# Altium schematic sheet Sheet1.SchDoc
size B; Organization: Cobus Projects; Revision: 1.0; Time: Shared Circuitry; ProjectName: Wireless Relay Controller
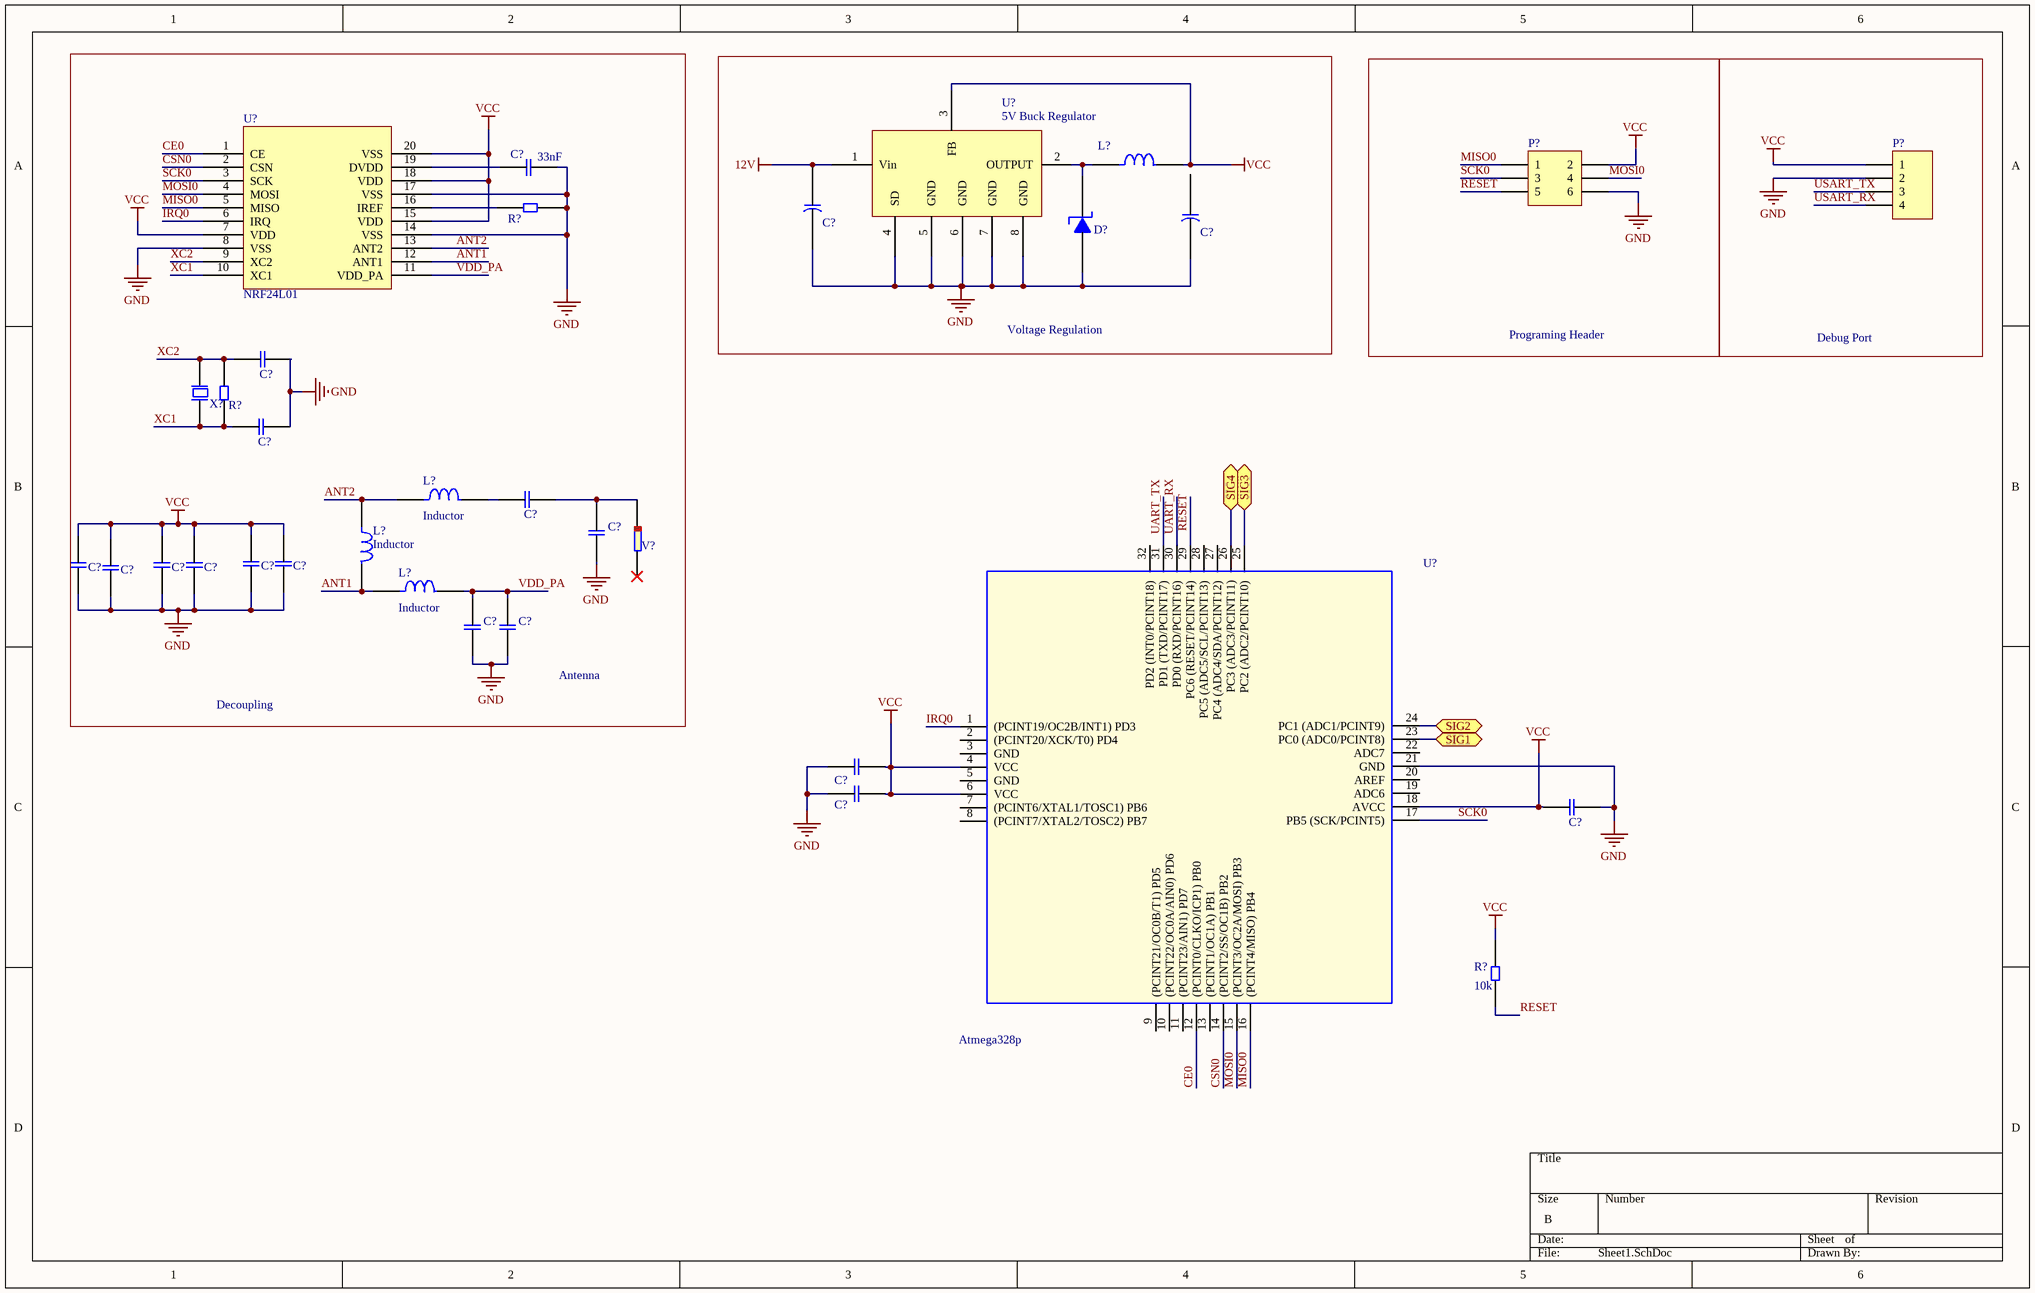
[diagram p0: Sheet1.SchDoc]

## Parts
(Parts that share a designator on the sheet are numbered #1, #2 ... from top to bottom, then left to right.)
C?#1  value 33nF  [0402-Footprint]  (hidden comment: *)
C?#2  Capacitor-Pol  (value not drawn)
C?#3  Capacitor-Pol  (value not drawn)
C?#4  *  [0402-Footprint]  (value not drawn)
C?#5  *  [0402-Footprint]  (value not drawn)
C?#6  *  [0402-Footprint]  (value not drawn)
C?#7  *  [0402-Footprint]  (value not drawn)
C?#8  *  [0402-Footprint]  (value not drawn)
C?#9  *  [0402-Footprint]  (value not drawn)
C?#10  *  [0402-Footprint]  (value not drawn)
C?#11  *  [0402-Footprint]  (value not drawn)
C?#12  *  [0402-Footprint]  (value not drawn)
C?#13  *  [0402-Footprint]  (value not drawn)
C?#14  *  [0402-Footprint]  (value not drawn)
C?#15  *  [0402-Footprint]  (value not drawn)
C?#16  Capacitor  [0402-Footprint]  (value not drawn)
C?#17  Capacitor  [0402-Footprint]  (value not drawn)
C?#18  Capacitor  [0402-Footprint]  (value not drawn)
D?  Schottky Diode  [SOT95P245X110-3N]  (value not drawn)
L?#1  Inductor  [INDP127127X40N]  (value not drawn)
L?#2  Inductor  [0402-Footprint]
L?#3  Inductor  [0402-Footprint]
L?#4  Inductor  [0402-Footprint]
P?#1  (no value)  [HDR2X3]
P?#2  (no value)  [HDR1X4]
R?#1  *  [0402-Footprint]  (value not drawn)
R?#2  *  [0402-Footprint]  (value not drawn)
R?#3  value 10k  [0402-Footprint]  (hidden comment: Resistor)
U?#1  5V Buck Regulator  [SOP127P600X175-8N]
U?#2  NRF24L01  [QFN50P408X408X80_HS-21N]
U?#3  Atmega328p  [TQFP80P900X900X120-32N]
V?  ANTENNA  [Chip Antenna]  (value not drawn)
X?  *  [HC49/US]  (value not drawn)

## Blocks framed on the sheet
Voltage Regulation: C?#2 C?#3 D? L?#1 U?#1

## Ports
SIG1 (bidir), SIG2 (bidir), SIG3 (bidir), SIG4 (bidir)

## Nets
12V: C?#2.1 U?#1.1(Vin)
GND: C?#1.2 C?#2.2 C?#3.2 C?#4.2 C?#5.2 C?#7.2 C?#8.2 C?#9.2 C?#10.2 C?#11.2 C?#12.2 C?#13.2 C?#14.2 C?#15.2 C?#16.1 C?#17.1 C?#18.2 D?.1 P?#1.6 P?#2.2 R?#1.2 U?#1.4(SD) U?#1.5(GND) U?#1.6(GND) U?#1.7(GND) U?#1.8(GND) U?#2.8(VSS) U?#2.14(VSS) U?#2.17(VSS) U?#3.21(GND)
VCC: C?#8.1 C?#9.1 C?#10.1 C?#11.1 C?#12.1 C?#13.1 C?#16.2 C?#17.2 C?#18.1 L?#1.2 P?#1.2 P?#2.1 R?#3.2 U?#1.3(FB) U?#2.7(VDD) U?#2.15(VDD) U?#2.18(VDD) U?#2.20(VSS) U?#3.4(VCC) U?#3.6(VCC) U?#3.18(AVCC)
ANT1: L?#2.2 L?#4.1 U?#2.12(ANT1)
ANT2: L?#2.1 L?#3.1 U?#2.13(ANT2)
CE0: U?#2.1(CE) U?#3.12((PCINT0/CLKO/ICP1)_PB0)
CSN0: U?#2.2(CSN) U?#3.14((PCINT2/SS/OC1B)_PB2)
IRQ0: U?#2.6(IRQ) U?#3.1((PCINT19/OC2B/INT1)_PD3)
MISO0: P?#1.1 U?#2.5(MISO) U?#3.16((PCINT4/MISO)_PB4)
MOSI0: P?#1.4 U?#2.4(MOSI) U?#3.15((PCINT3/OC2A/MOSI)_PB3)
RESET: P?#1.5 R?#3.1 U?#3.29(PC6_(RESET/PCINT14))
SCK0: P?#1.3 U?#2.3(SCK) U?#3.17(PB5_(SCK/PCINT5))
SIG1: U?#3.23(PC0_(ADC0/PCINT8)) ; port SIG1
SIG2: U?#3.24(PC1_(ADC1/PCINT9)) ; port SIG2
SIG3: U?#3.25(PC2_(ADC2/PCINT10)) ; port SIG3
SIG4: U?#3.26(PC3_(ADC3/PCINT11)) ; port SIG4
UART_RX: U?#3.30(PD0_(RXD/PCINT16))
UART_TX: U?#3.31(PD1_(TXD/PCINT17))
USART_RX: P?#2.4
USART_TX: P?#2.3
VDD_PA: C?#14.1 C?#15.1 L?#4.2 U?#2.11(VDD_PA)
XC1: C?#5.1 R?#2.1 U?#2.10(XC1) X?.1
XC2: C?#4.1 R?#2.2 U?#2.9(XC2) X?.2
NetC?#1_1: C?#1.1 U?#2.19(DVDD)
NetC?#6_1: C?#6.1 L?#3.2
NetC?#6_2: C?#6.2 C?#7.1 V?.1
NetD?_3: D?.3 L?#1.1 U?#1.2(OUTPUT)
NetR?#1_1: R?#1.1 U?#2.16(IREF)

Not connected (* = marked no-connect by the designer): C?#3 1; U?#3 2((PCINT20/XCK/T0)_PD4) 3(GND) 5(GND) 7((PCINT6/XTAL1/TOSC1)_PB6) 8((PCINT7/XTAL2/TOSC2)_PB7) 9((PCINT21/OC0B/T1)_PD5) 10((PCINT22/OC0A/AIN0)_PD6) 11((PCINT23/AIN1)_PD7) 13((PCINT1/OC1A)_PB1) 19(ADC6) 20(AREF) 22(ADC7) 27(PC4_(ADC4/SDA/PCINT12)) 28(PC5_(ADC5/SCL/PCINT13)) 32(PD2_(INT0/PCINT18)); V? 2*

## Notes on the sheet
- Programing Header
- Debug Port
- Decoupling
- Antenna

## Library data of the parts
C?#1 C?#4-C?#15 = Capacitor
C?#2 C?#3 = Capacitor-Pol: value: 20pF
D? = Diode-Scchottky: Part #: BAT54-FDICT-ND
P?#1 = Header 3X2: Header, 3-Pin, Dual row; LatestRevisionDate: 17-Jul-2002; LatestRevisionNote: Re-released for DXP Platform.; Publisher: Altium Limited
P?#2 = Header 4: Header, 4-Pin; LatestRevisionDate: 17-Jul-2002; LatestRevisionNote: Re-released for DXP Platform.; Publisher: Altium Limited
R?#1 R?#2 = Resistor
U?#1 = AP1509-Buck_Regulator
U?#2 = NRF24L01+
U?#3 = Atmega329p
X? = Crystal: Part #: ECS-160-20-3X-TR